# EAGLE design 3s_1g (EAGLE 4.16)
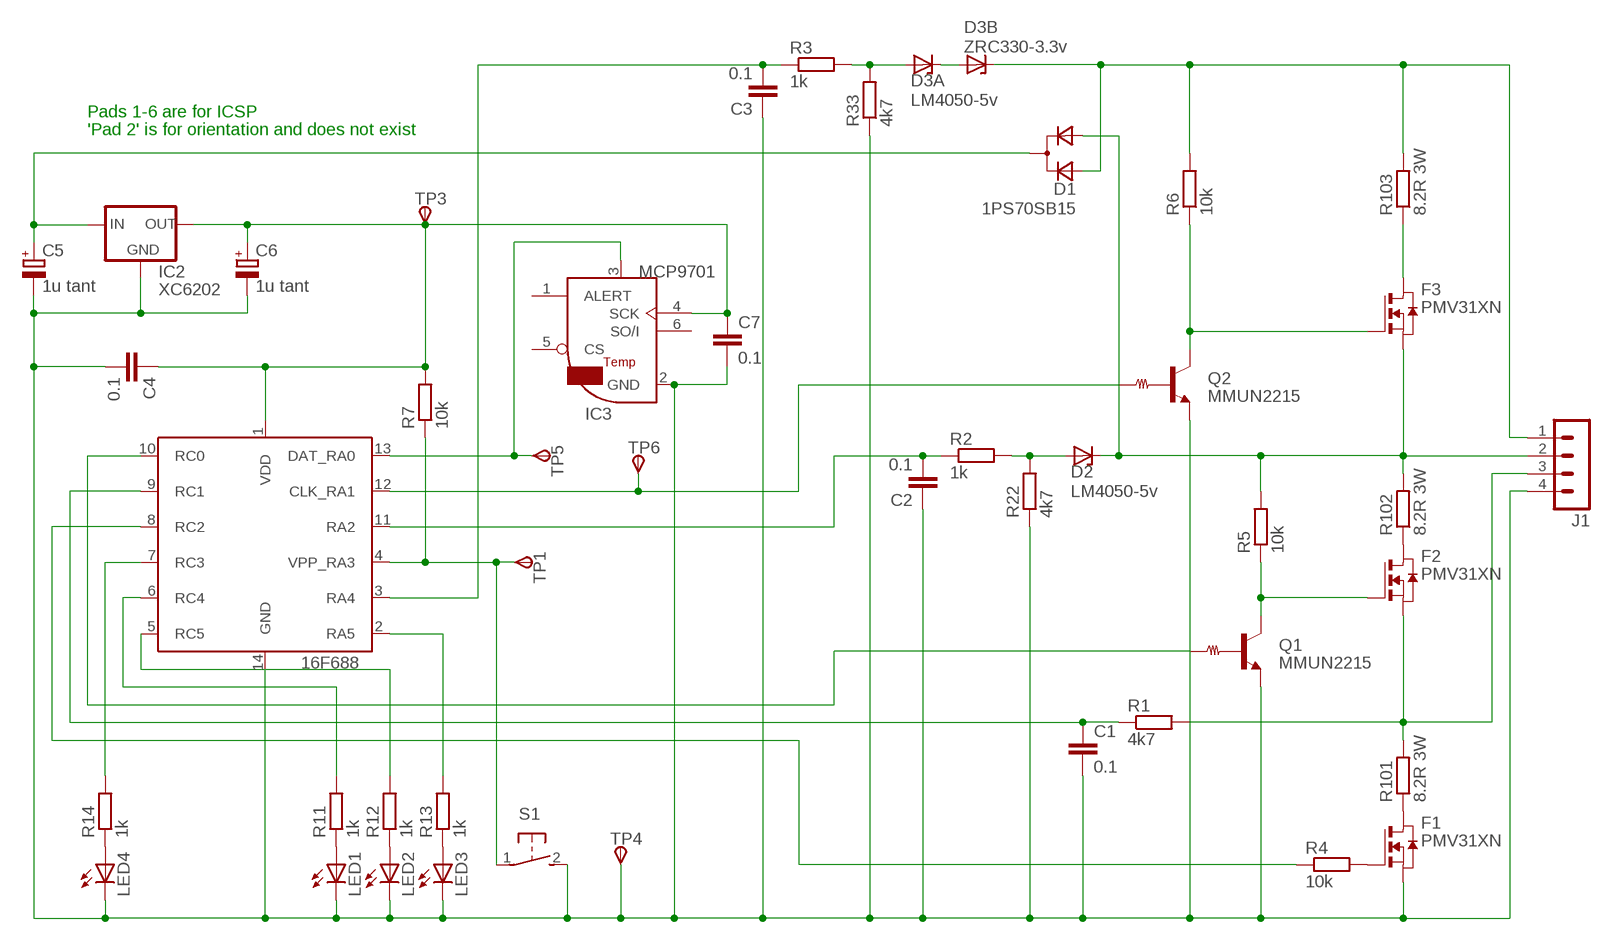
[diagram p0: schematic, sheet 1]

## Parts
C1  0.1  C-EUC0805  [C0805]
C2  0.1  C-EUC0805  [C0805]
C3  0.1  C-EUC0805  [C0805]
C4  0.1  C-EUC0805  [C0805]
C5  1u tant  CPOL-EUA/3216-18R  [A/3216-18R]
C6  1u tant  CPOL-EUA/3216-18R  [A/3216-18R]
C7  0.1  C-EUC0805  [C0805]
D1  1PS70SB15  D_2ASOT23  [SOT-23]
D2  LM4050-5v  ZENER-DIODESOT23  [SOT23]
D3A  LM4050-5v  ZENER-DIODESOT23  [SOT23]
D3B  ZRC330-3.3v  ZENER-DIODESOT23  [SOT23]
F1  PMV31XN  NMOSSOT23  [SOT-23]
F2  PMV31XN  NMOSSOT23  [SOT-23]
F3  PMV31XN  NMOSSOT23  [SOT-23]
IC1  PIC16F688SOIC14  [SOIC14]
IC2  XC6202  XC63FPM  [SOT23]
J1  MA04-1  [MA04-1]
LED1  LEDCHIP-LED0603  [CHIP-LED0603]
LED2  LEDCHIP-LED0603  [CHIP-LED0603]
LED3  LEDCHIP-LED0603  [CHIP-LED0603]
LED4  LEDCHIP-LED0603  [CHIP-LED0603]
MCP9701  IC3  TMP122  [SOT23-6]
Q1  MMUN2215  MUN2214T1-NPN_DRIVER-SC59-BEC  [SC59-BEC]
Q2  MMUN2215  MUN2214T1-NPN_DRIVER-SC59-BEC  [SC59-BEC]
R1  4k7  R-EU_R0805  [R0805]
R2  1k  R-EU_R0805  [R0805]
R3  1k  R-EU_R1206  [R1206]
R4  10k  R-EU_R0805  [R0805]
R5  10k  R-EU_R0805  [R0805]
R6  10k  R-EU_R0805  [R0805]
R7  10k  R-EU_R0805  [R0805]
R11  1k  R-EU_R0805  [R0805]
R12  1k  R-EU_R0805  [R0805]
R13  1k  R-EU_R0805  [R0805]
R14  1k  R-EU_R0805  [R0805]
R22  4k7  R-EU_R0805  [R0805]
R33  4k7  R-EU_R0805  [R0805]
R101  8.2R 3W  R-EU_M3516  [M3516]
R102  8.2R 3W  R-EU_M3516  [M3516]
R103  8.2R 3W  R-EU_M3516  [M3516]
S1  DTSM-3  [DTSM-3]
TP1  TPSTP06SQ  [TP06SQ]
TP3  TPSTP06SQ  [TP06SQ]
TP4  TPSTP06SQ  [TP06SQ]
TP5  TPSTP06SQ  [TP06SQ]
TP6  TPSTP06SQ  [TP06SQ]

## Nets
N$1: IC1.4(VPP_RA3) R7.1 S1.1 TP1.TP(PP)
N$2: F1.1(D) R101.1
N$3: D2.1(A) R2.2 R22.2
N$4: LED4.A R14.1
N$5: IC1.7(RC3) R14.2
N$6: F2.3(G) Q1.C R5.1
N$7: F3.3(G) Q2.C R6.1
N$8: LED1.A R11.1
N$10: LED2.A R12.1
N$11: IC1.10(RC0) Q1.B
N$12: F3.1(D) R103.1
N$13: C1.1 IC1.9(RC1) R1.1
N$14: D3A.1(A) R3.2 R33.2
N$15: IC1.2(RA5) R13.2
N$17: C5.+ D1.1(C) IC2.3(IN)
N$18: D1.3(A2) D2.3(C) F3.2(S) J1.2 R5.2 R102.2
N$19: C1.2 C2.1 C3.1 C4.2 C5.- C6.- C7.2 F1.2(S) IC1.14(GND) IC2.1(GND) J1.4 LED1.C LED2.C LED3.C LED4.C MCP9701.2(GND) Q1.E Q2.E R22.1 R33.1 S1.2 TP4.TP(PP)
N$20: C4.1 C6.+ C7.1 IC1.1(VDD) IC2.2(OUT) MCP9701.4(SCK) R7.2 TP3.TP(PP)
N$21: IC1.13(DAT_RA0) MCP9701.3(UCC) TP5.TP(PP)
N$22: F2.1(D) R102.1
N$23: F2.2(S) J1.3 R1.2 R101.2
N$24: LED3.A R13.1
N$25: D1.2(A1) D3B.3(C) J1.1 R6.2 R103.2
N$26: IC1.12(CLK_RA1) Q2.B TP6.TP(PP)
N$27: IC1.5(RC5) R12.2
N$28: IC1.6(RC4) R11.2
N$29: F1.3(G) R4.2
N$31: IC1.8(RC2) R4.1
N$33: D3A.3(C) D3B.1(A)
N$34: C3.2 IC1.3(RA4) R3.1
N$35: C2.2 IC1.11(RA2) R2.1
Unconnected: MCP9701.1(ALERT) MCP9701.5(CS) MCP9701.6(SO/I)

## Notes on the sheet
- Pads 1-6 are for ICSP
- 'Pad 2' is for orientation and does not exist

## Library data of the parts
C1-C4 C7 = rcl:C-EU: CAPACITOR, European symbol
C5 C6 = rcl:CPOL-EU: POLARIZED CAPACITOR, European symbol
D1 = zetex:D_2A: Dual DIODE
D2 D3A D3B = diode:ZENER-DIODE: Z-Diode
F1-F3 = zetex:NMOSSOT23: MOS FET
IC1 = microchip-16f688:PIC16F688
IC2 = v-reg:XC63FP: Positiv Voltage Regulators www.torex.co.jp/english/product/pro02/pdf/0201_xc62fp.pdf
J1 = con-lstb:MA04-1: PIN HEADER
LED1-LED4 = led:LED: LED OSRAM: - CHIPLED LG R971, LG N971, LY N971, LG Q971, LY Q971, LO R971, LY R971 LH N974, LH R974 LS Q976, LO Q976, LY Q976 LO Q996 - Hyper CHIPLED LW Q18S LB Q993, LB Q99A, LB R99A - SideLED LS A670, LO A670, LY A670, LG A670, LP A670 LB A673, LV A673, LT A673, LW A673 LH A674 LY A675 LS A676, LA A676, LO A676, LY A676, LW A676 LS A679, LY A679, LG A679 - Hyper Micro SIDELED® LS Y876, LA Y876, LO Y876, LY Y876 LT Y87S - SmartLED LW L88C, LW L88S LB L89C, LB L89S, LG L890 LS L89K, LO L89K, LY L89K LS L896, LA L896, LO L896, LY L896 - TOPLED LS T670, LO T670, LY T670, LG T670, LP T670 LSG T670, LSP T670, LSY T670, LOP T670, LYG T670 LG T671, LOG T671, LSG T671 LB T673, LV T673, LT T673, LW T673 LH T674 LS T676, LA T676, LO T676, LY T676, LB T676, LH T676, LSB T676, LW T676 LB T67C, LV T67C, LT T67C, LS T67K, LO T67K, LY T67K, LW E67C LS E67B, LA E67B, LO E67B, LY E67B, LB E67C, LV E67C, LT E67C LW T67C LS T679, LY T679, LG T679 LS T770, LO T770, LY T770, LG T770, LP T770 LB T773, LV T773, LT T773, LW T773 LH T774 LS E675, LA E675, LY E675, LS T675 LS T776, LA T776, LO T776, LY T776, LB T776 LHGB T686 LT T68C, LB T68C - Hyper Mini TOPLED® LB M676 - Mini TOPLED Santana® LG M470 LS M47K, LO M47K, LY M47K Source: http://www.osram.convergy.de/
MCP9701 = termosensor:TMP12*
Q1 Q2 = transistor:*-NPN_DRIVER-: NPN Bias Resistor Transistor
R1-R7 R11-R14 R22 R33 R101-R103 = rcl:R-EU_: RESISTOR, European symbol
S1 = switch-tact:DTSM-3
TP1 TP3-TP6 = testpad:TPS: TEST PIN

## Board
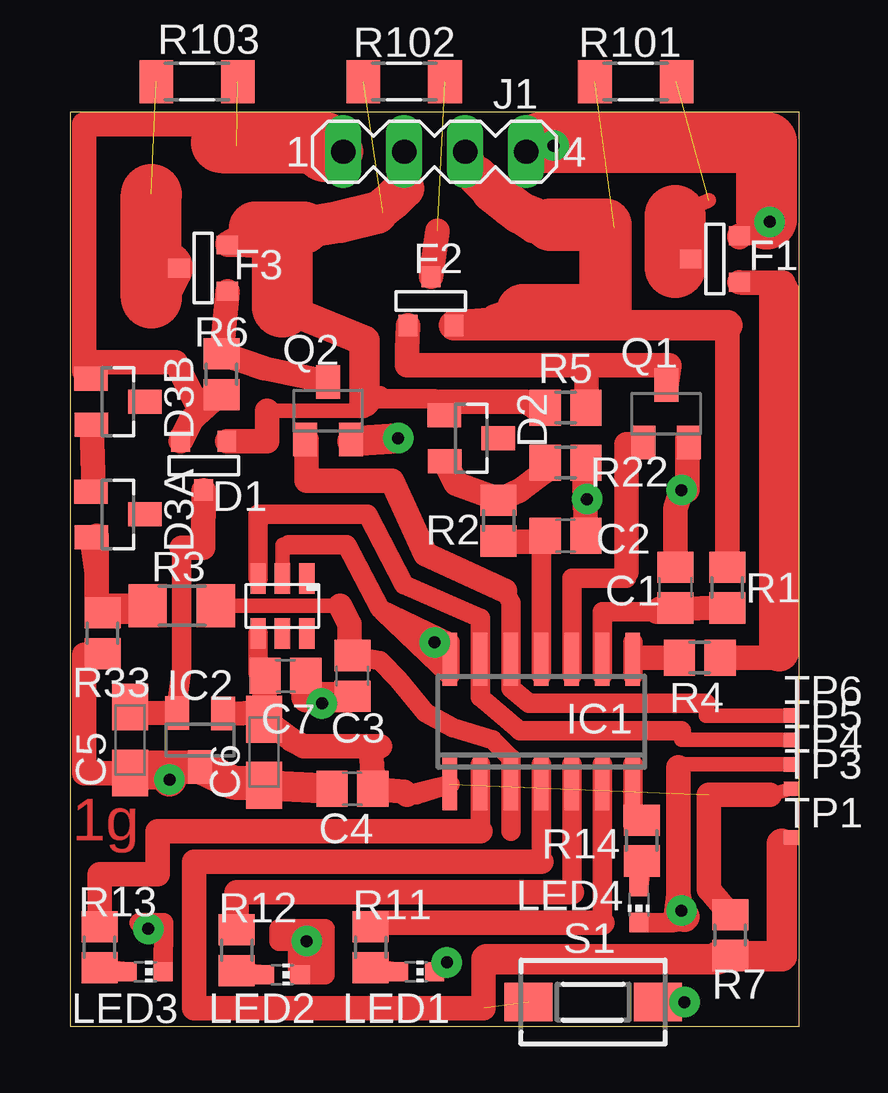
[diagram p1: board, top side]
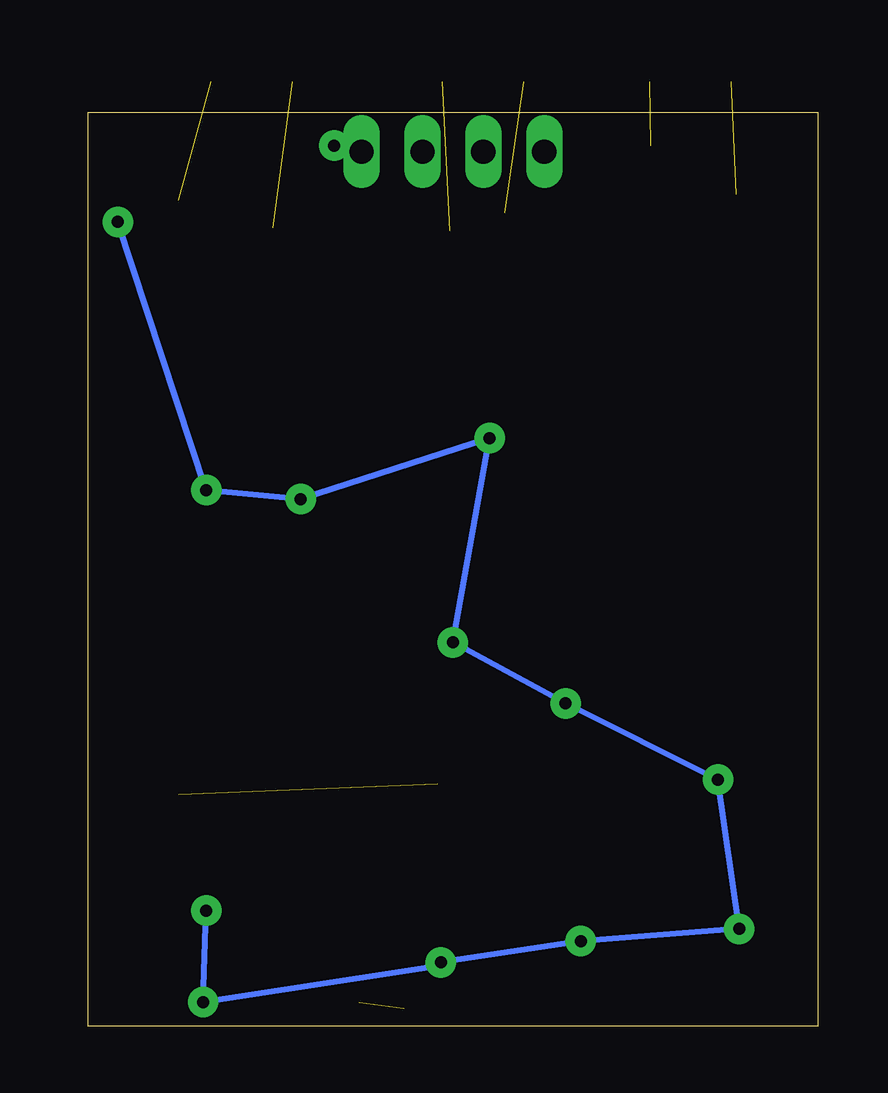
[diagram p2: board, bottom side, seen from below]

Size 30.4 x 38.09 mm. Coordinates in mm from the lower left corner, seen from the top.
Outline: 0,0 30.4,0 30.4,38.09 0,38.09 0,0
Copper layers (1*16): Top 0.035mm / dielectric 1.5mm / Bottom 0.035mm
Design rules "default": minimum track width 10mil, minimum drill 24mil, track to track 8mil, track to pad 8mil, pad to pad 8mil, via to via 8mil, smd to smd 8mil, copper to edge 40mil, drill to drill 8mil, minimum pad ring 10mil, minimum via ring 8mil, stop-mask expansion 4mil, vias tented up to drill 0mil, thermal gap 10mil

### Footprints (pad centres in the part's own frame; a part is rotated, then mirrored left to right if it is on the bottom)
C0805 = smd 1.3 x 1.5: 1 -0.85,0; 2 0.85,0
A/3216-18R = smd 1.95 x 1.5: + 1.375,0; - -1.375,0
SOT-23 = smd 0.787 x 0.889: 1 0.025,-1.016; 2 -0.94,1.016; 3 0.991,1.016
SOT23 = smd 1 x 1.4: 1 0.955,-1.1; 2 -0.003,1.123; 3 -0.953,-1.123
SOIC14 = smd 0.6 x 2.2: 1 -3.81,-2.6; 2 -2.54,-2.6; 3 -1.27,-2.6; 4 0,-2.6; 5 1.27,-2.6; 6 2.54,-2.6; 7 3.81,-2.6; 8 3.81,2.6; 9 2.54,2.6; 10 1.27,2.6; 11 0,2.6; 12 -1.27,2.6; 13 -2.54,2.6; 14 -3.81,2.6
SOT23' = smd 1 x 1.4: 1 0.003,1.123; 2 -0.955,-1.1; 3 0.953,-1.123
MA04-1 = drill 1.016 long: 1 -3.81,0; 2 -1.27,0; 3 1.27,0; 4 3.81,0
CHIP-LED0603 = smd 0.8 x 0.8: A 0,-0.75; C 0,0.75
SOT23-6 = smd 0.635 x 1.27: 1 1.27,-0.254; 2 2.286,-0.254; 3 3.302,-0.254; 4 3.302,2.032; 5 2.286,2.032; 6 1.27,2.032
SC59-BEC = smd 1 x 1.4: B -0.95,-1.2; C 0,1.2; E 0.95,-1.2
R0805 = smd 1.3 x 1.5: 1 -0.85,0; 2 0.85,0
R1206 = smd 1.6 x 1.803: 1 -1.422,0; 2 1.422,0
M3516 = smd 1.4 x 1.8: 1 -1.7,0; 2 1.7,0
DTSM-3 = smd 2 x 1.6: 1 -2.7,0; 2 2.7,0
TP06SQ = smd 0.6 x 0.6: TP 0,0

### Placement (x,y rotation side)
C1  25.24,18.28 90 top
C2  20.66,20.44 180 top
C3  11.77,14.6 90 top
C4  11.77,9.9 180 top
C5  2.5,11.93 90 top
C6  8.09,11.43 90 top
C7  8.98,14.6 0 top
D1  5.55,23.36 0 top
D2  16.73,24.51 270 top
D3A  1.99,21.33 270 top
D3B  1.99,26.03 270 top
F1  26.89,32 270 top
F2  15.07,30.22 180 top
F3  5.55,31.62 270 top
IC1  19.65,12.69 0 top
IC2  XC6202  [SOT23']  5.42,11.93 180 top
J1  15.2,36.44 0 top
LED1  14.44,2.28 270 top
LED2  8.85,2.15 270 top
LED3  3.14,2.28 270 top
LED4  23.71,5.07 180 top
MCP9701  11.14,18.41 180 top
Q1  24.85,25.52 0 top
Q2  10.76,25.65 0 top
R1  27.39,18.28 90 top
R2  17.87,21.08 90 top
R3  4.66,17.52 180 top
R4  26.25,15.36 0 top
R5  20.66,25.78 180 top
R6  6.31,27.17 270 top
R7  27.52,3.8 90 top
R11  12.54,3.3 90 top
R12  6.95,3.17 90 top
R13  1.23,3.3 90 top
R14  23.84,7.74 90 top
R22  20.66,23.49 180 top
R33  1.36,16.38 90 top
R101  23.58,39.36 180 top
R102  13.93,39.36 180 top
R103  5.3,39.36 0 top
S1  21.81,1.01 0 top
TP1  30.06,7.87 0 top
TP3  30.06,9.9 0 top
TP4  30.06,10.92 0 top
TP5  30.06,11.93 0 top
TP6  30.06,12.95 0 top

### Tracks (layer width: path | path; a pad name or v marks a point on that pad's centre or on a via)
N$1  (1 unrouted)
  Top 0.61: 29.68,7.61 TP1.TP
  Top 0.813: 19.65,6.85 IC1.4 | IC1.4 19.65,10.92 | IC1.4 19.65,10.28 | R7.1 27.9,2.95 27.9,2.92
  Top 1.016: 19.65,6.85 5.17,6.85 5.17,0.76 17.23,0.76 17.23,2.79 17.36,2.79 | 27.01,2.79 27.01,2.92
  Top 1.27: 27.01,2.92 27.9,2.92 29.68,2.92 29.68,7.61 | 17.36,2.79 27.01,2.79
N$2  (1 unrouted)
  Top 0.61: 25.24,33.78 26.63,34.41
  Top 1.016: F1.1 25.24,31.62
  Top 2.54: 25.24,31.62 25.24,33.78
N$3
  Top 1.016: R22.2 19.77,23.11 18.76,22.35 R2.2 17.87,21.97 16.09,22.6 D2.1
N$4
  Top 0.813: LED4.A 23.71,5.84 R14.1
N$5
  Top 0.813: 23.46,10.92 IC1.7 23.46,8.38 24.09,8.5 R14.2
N$6
  Top 1.016: Q1.C 24.98,27.55 21.55,27.55 | 21.55,27.55 14.06,27.55 14.06,28.19 F2.3 | 21.55,27.55 R5.1
N$7
  Top 1.016: Q2.C 8.09,27.43 R6.1 F3.3
N$8
  Top 0.813: LED1.A 13.55,2.28 R11.1
N$10
  Top 0.813: R12.1 6.95,2.28 LED2.A
N$11
  Top 0.813: 20.92,14.6 IC1.10 20.92,18.66 23.2,18.66 23.2,18.92
  Top 1.016: 23.2,18.92 23.2,24.25 23.71,24.25 Q1.B
N$12  (1 unrouted)
  Top 1.016: F3.1 4.03,31.62
  Top 2.184: 4.03,31.62 3.39,30.35
  Top 2.54: 3.39,30.35 3.39,34.67
N$13
  Top 0.813: 24.47,17.27 22.19,17.27 IC1.9 22.19,14.6
  Top 1.016: R1.1 25.11,17.39 C1.1 24.6,17.39 24.47,17.27
N$14
  Top 1.016: 3.01,17.52 1.11,17.52 1.11,18.92 | 1.11,18.92 1.11,20.44 | R33.2 2.76,17.27 3.01,17.52 | 3.01,17.52 R3.2 | 1.11,18.92 D3A.1
N$15
  Top 0.813: 17.11,8.12 IC1.2 | IC1.2 17.11,10.92 | IC1.2 17.11,10.15
  Top 1.016: 17.11,8.12 3.64,8.12 3.64,6.34 1.23,6.34 R13.2
N$17
  Top 0.813: 4.66,19.93 4.66,14.85 4.41,13.08
  Top 1.016: D1.1 5.55,19.93 4.66,19.93 | 4.41,13.08 IC2.3 2.5,13.08 C5.+
N$18  (1 unrouted)
  Top 0.254: J1.2 12.92,34.03
  Top 0.61: 8.22,25.65 12.28,25.65 | 12.28,25.65 12.92,26.28 | 12.28,25.65 12.28,26.03 | J1.2 13.04,33.9
  Top 0.813: 12.92,26.28 12.92,26.16 15.2,26.16 15.46,26.03
  Top 1.016: R5.2 19.39,25.78 19.01,26.03 15.46,26.03 15.46,25.52 D2.3 | 7.71,33.27 6.57,32.63 F3.2 8.85,32.51 | 13.93,34.92 13.04,34.16 12.54,33.78 | D1.3 8.22,24.38 8.22,25.65
  Top 1.27: 8.85,29.97 12.28,28.57 12.28,26.03
  Top 1.422: 13.93,34.92 J1.2
  Top 1.676: 13.93,34.92 13.42,34.41 12.79,33.9
  Top 1.778: 12.79,33.9 11.26,33.52 9.74,33.27
  Top 2.184: 7.71,33.27 9.74,33.27
  Top 2.54: 8.85,29.97 8.85,32.51
N$19  (via drill 0.5 pad 1.27)
  Top 0.254: v25.62,1.01 S1.2 | C3.1 v10.5,13.46 11.65,13.71 | v15.2,16 15.84,16 | v21.55,21.97 C2.1 | Q1.E 25.87,24.51 v25.49,22.35 | v29.17,33.52 27.9,32.89
  Top 0.61: MCP9701.2 8.85,20.06 9.11,20.06 | TP4.TP 25.49,10.92 25.36,10.79
  Top 0.813: 9.11,20.06 11.52,20.06 12.92,17.39 15.84,16 15.84,14.6 | LED4.C 25.11,4.31 25.24,4.44 | LED3.C 3.9,4.31 2.88,4.31 v3.26,4.06 | LED2.C 10.63,2.15 10.63,4.06 8.72,4.06 8.72,3.55 9.49,3.55 | v9.87,3.55 10,3.55 | v9.87,3.55 9.49,3.55 | 9.49,3.55 9.49,2.15 10,2.28 10.12,3.55 v9.87,3.55 | v15.71,2.66 LED1.C | 15.84,14.6 IC1.14 | 15.84,14.6 13.04,17.27 v15.2,16
  Top 1.016: F1.2 27.9,32.89 29.04,33.65 | R22.1 21.43,23.36 C2.1 | C1.2 25.24,21.58 v25.49,22.35 25.74,22.35 25.74,24.51 Q1.E | 25.36,5.46 25.24,4.44 | C3.1 11.77,13.84 v10.5,13.46 | 11.77,24.38 Q2.E | v25.49,4.82 25.36,5.46 | 25.36,5.46 25.36,10.79 | R33.1 0.6,15.49 0.6,10.54 2.38,10.54 C5.-
  Top 1.27: v25.49,4.82 25.62,4.57 | C7.2 9.87,13.71 11.65,13.71 C3.1 | v13.68,24.51 11.77,24.38 | C4.2 10.88,9.9 C6.-
  Top 1.422: 19.65,36.83 J1.4 | v4.15,10.28 4.15,10.54 C5.- 2.63,10.79 IC2.1 6.82,10.15 8.09,10.15 C6.-
  Top 2.54: 19.65,36.83 29.04,36.83 29.04,33.65
  Bottom 0.254: v25.49,4.82 v25.62,1.01 15.71,2.54 v15.71,2.66 v9.87,3.55 v3.26,4.06 v4.15,10.28 v10.5,13.46 v15.2,16 v13.68,24.51 v21.55,21.97 v25.49,22.35 v29.17,33.52
N$20  (1 unrouted)
  Top 0.61: 29.17,9.65 TP3.TP
  Top 0.813: C7.1 7.84,14.73 MCP9701.4 | 14.06,9.65 IC1.1 14.44,9.65
  Top 1.016: R7.2 26.63,5.71 26.63,9.65 29.17,9.65 | 8.09,12.82 8.09,13.08 IC2.2 | 8.09,12.82 C6.+ 9.23,11.93 9.74,11.68 12.54,11.68 | 8.09,12.82 C7.1 | 12.54,11.68 12.92,11.68 | 12.54,11.68 12.66,10.03 C4.1 13.93,9.77 14.06,9.65
N$21
  Top 0.61: TP5.TP 25.49,11.93 25.49,12.31
  Top 0.813: MCP9701.3 7.84,21.33 12.41,21.33 13.93,18.41 17.11,17.01 | 17.11,17.01 IC1.13 | 17.11,17.01 17.11,13.71 18.76,12.31 25.49,12.31
N$22  (1 unrouted)
  Top 1.016: F2.1 15.33,33.14
N$23  (1 unrouted)
  Top 0.61: 20.66,33.27 22.69,33.27
  Top 1.016: F2.2 16.09,29.33 17.74,29.46 | J1.3 16.73,35.3 18.12,33.9 19.27,33.14 22.31,33.4 20.66,33.27 | 27.39,29.21 R1.2
  Top 1.27: 17.74,29.46 18.89,29.84 | F2.2 27.39,29.21
  Top 1.422: J1.3 16.6,35.94 16.98,35.43
  Top 1.676: 17.61,34.79 16.98,35.43
  Top 1.778: 17.61,34.79 18.76,33.9 20.03,33.4
  Top 2.184: 20.03,33.4 22.31,33.4 22.31,29.84 18.89,29.84
N$24
  Top 0.813: R13.1 1.36,2.41 LED3.A
N$25  (1 unrouted)
  Top 0.61: 6.31,37.59 6.95,36.7
  Top 1.016: 6.31,36.83 6.31,37.59 0.6,37.59 0.6,27.3 D3B.3 0.98,27.68 4.41,27.68 5.32,25.85 | 5.04,25.27 D1.2 | R6.2 6.31,26.41 5.04,25.27 | 5.44,25.63 5.42,25.65 5.32,25.85 | 5.04,25.27 6.18,26.41 5.42,25.9 5.32,25.85
  Top 1.676: 10.63,36.44 J1.1
  Top 2.54: 10.63,36.44 10.63,36.83 6.31,36.83
N$26
  Top 0.61: 26.5,13.46 26.5,12.95 TP6.TP
  Top 0.813: 18.12,18.16 18.38,17.65 IC1.12 | IC1.12 18.38,14.6 | IC1.12 18.38,14.09 19.14,13.46 26.5,13.46
  Top 1.016: Q2.B 9.87,24.45 9.87,22.73 13.42,22.73 14.82,19.68 18.12,18.16
N$27
  Top 0.61: 20.92,10.41 20.92,10.54
  Top 0.813: 20.92,5.58 IC1.5 20.92,10.41 20.92,10.92
  Top 1.016: R12.2 6.95,5.58 20.92,5.58
N$28
  Top 0.813: 22.19,4.31 IC1.6 22.19,10.92
  Top 1.016: R11.2 12.66,4.31 22.19,4.31
N$29
  Top 1.016: F1.3 28.03,30.98 29.73,30.98 29.55,30.6 | R4.2 29.43,15.36 29.55,15.62
  Top 1.676: 29.55,30.6 29.55,15.62
N$30  (via drill 0.5 pad 1.27)
  other vias: 20.15,36.7
N$31
  Top 0.813: 23.46,14.6 IC1.8 23.46,15.36 | 23.46,16 23.46,15.36 | 23.46,15.36 23.71,15.36
  Top 1.016: 23.71,15.36 R4.1
N$33
  Top 1.016: D3A.3 0.98,22.35 D3B.1
N$34
  Top 0.61: R3.1 11.26,17.52
  Top 0.813: 18.38,8.12 IC1.3 18.38,11.17 17.61,11.93 15.96,12.44 14.82,13.08 13.68,14.47 12.92,15.24 C3.2
  Top 1.016: 11.26,17.52 11.65,16.76 11.65,15.49 C3.2
N$35
  Top 0.813: 19.65,14.6 IC1.11 19.65,20.19 C2.2
  Top 1.016: R2.1 17.87,20.19 19.65,20.19

### Text on the board
Top: 1g
bOrigins: + | _